# EasyEDA Pro project _Mixer NEXT GEN V3_2026-02-06.epro, board PCB3.0
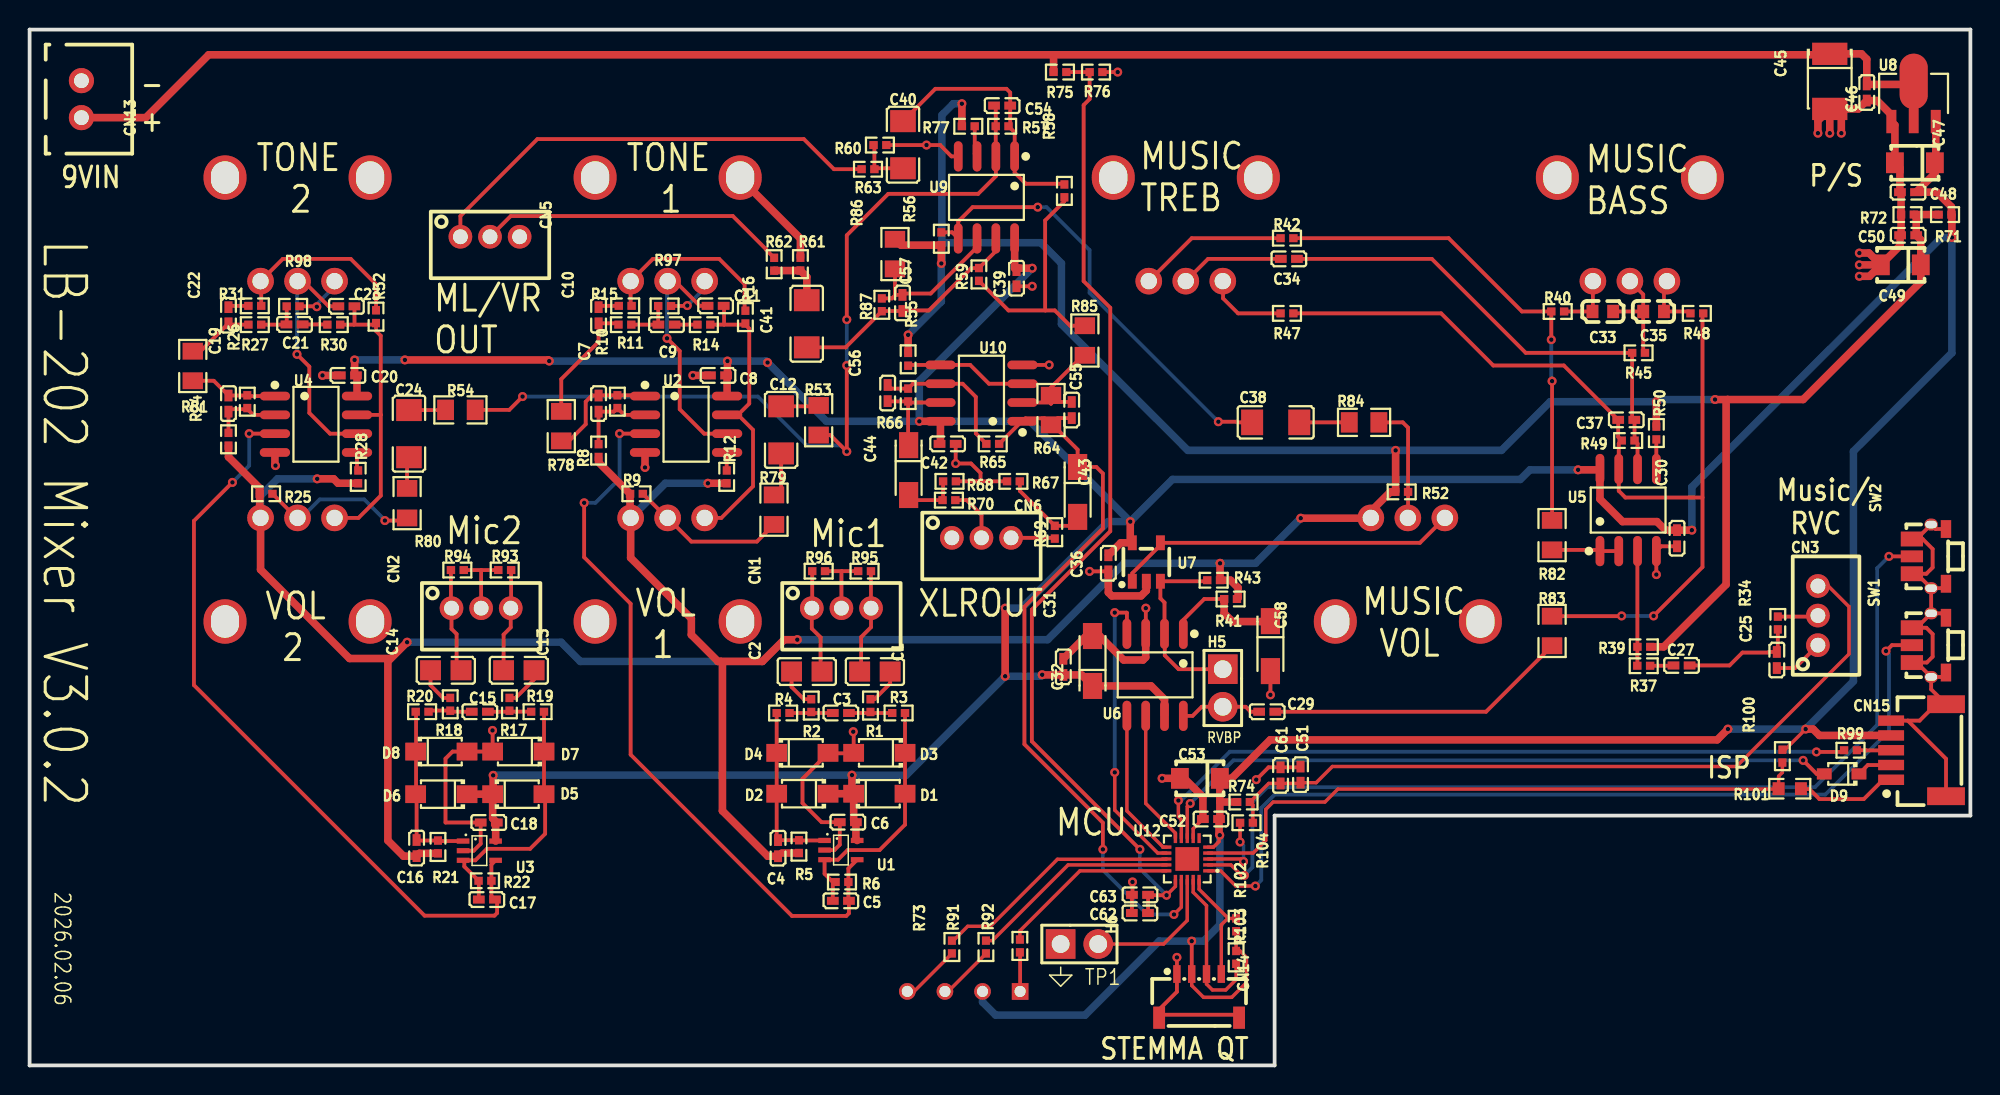
[diagram p6: board, top side]
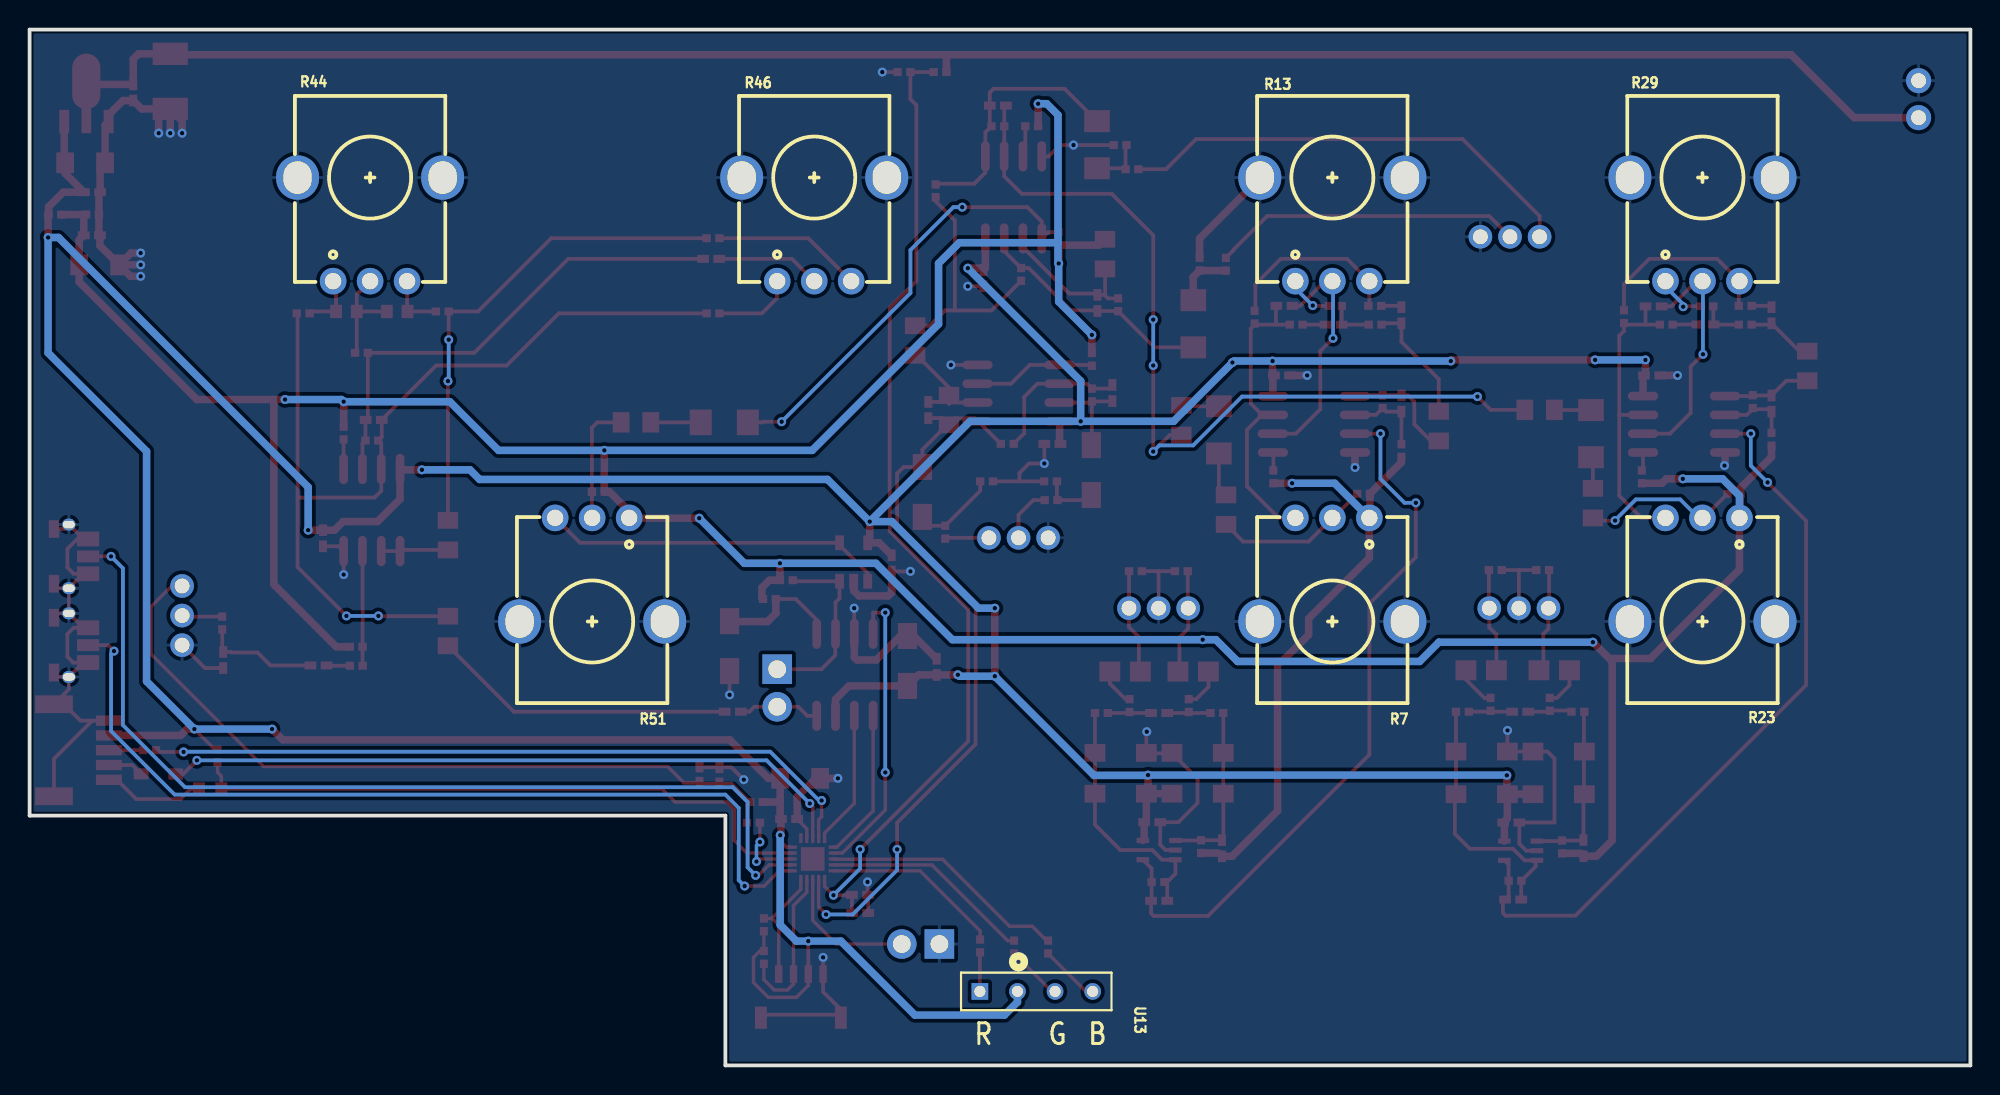
[diagram p7: board, bottom side, seen from below]

Outline 131.1 x 70 mm; copper layers: Top Layer, Bottom Layer. Coordinates in mm from the lower left corner of the outline.
Outline path: 0,70 131.1,70 131.1,16.88 84.1,16.88 84.1,0 0,0 0,70
Stack: Top Layer 0.035mm / Dielectric1 1.51mm FR4 er 4.5 / Bottom Layer 0.035mm

## Design rules (mm)
template: JLCPCB Capability(Two Layers Board)
spacing copperThickness1oz (default): track to track 0.102, other pairs 0.152 to 0.3
spacing copperThickness2oz: track to track 0.203, other pairs 0.152 to 0.3
track width copperThickness1oz (default): min 0.127, default 0.254, max 2.54
track width copperThickness2oz: min 0.203, default 0.254, max 2.54
differential pair differentialPair (default): width min 0.127, default 0.254, max 2.54; gap min 0.152, default 0.152
via viaSize (default): diameter min 0.5, default 0.61, max 10; hole min 0.3, default 0.305, max 6.3

## Placement (name value [footprint] x y rotation side)
C1  22uF  [C0805]  57.1 26.62 0 top
C2  22uF  [C0805]  52.5 26.62 180 top
C3  10nF  [C0402]  54.8 23.82 180 top
C4  20pF  [C0402]  50.56 14.68 270 top
C5  20pF  [C0402]  54.8 11.12 0 top
C6  100nF  [C0402]  55.27 16.44 0 top
C7  20pF  [C0402]  38.43 44.73 90 top
C8  100nF  [C0402]  46.5 46.63 0 top
C9  10nF  [C0402]  43.02 50.06 0 top
C10  10nF  [C0402]  38.43 50.7 90 top
C11  20pF  [C0402]  46.34 51.33 0 top
C12  10uF  [C1206]  50.77 42.95 90 top
C13  22uF  [C0805]  33.05 26.7 0 top
C14  22uF  [C0805]  28.11 26.7 180 top
C15  10nF  [C0402]  30.41 23.9 180 top
C16  20pF  [C0402]  26.14 14.69 270 top
C17  20pF  [C0402]  30.89 11.21 0 top
C18  100nF  [C0402]  31.02 16.42 0 top
C19  20pF  [C0402]  13.43 44.73 90 top
C20  100nF  [C0402]  21.5 46.63 0 top
C21  10nF  [C0402]  17.89 50.08 0 top
C22  10nF  [C0402]  13.43 50.7 90 top
C23  20pF  [C0402]  21.4 51.3 0 top
C24  10uF  [C1206]  25.63 42.69 90 top
C25  47pF  [C0402]  118.02 27.4 90 top
C27  1uF  [C0402]  111.59 27.03 180 top
C29  1uF  [C0402]  83.6 23.9 180 top
C30  100nF  [C0402]  111.28 35.63 270 top
C31  100nF  [C0402]  69.83 26.93 90 top
C32  10uF  [CAP-SMD_L3.2-W1.6-RD-C7171]  71.8 27.33 90 top
C33  47nF  [C0603]  106.27 50.95 180 top
C34  560pF  [C0402]  85.06 54.51 0 top
C35  47nF  [C0603]  109.7 50.95 0 top
C36  100nF  [C0402]  72.87 33.93 90 top
C37  20pF  [C0402]  107.85 43.63 180 top
C38  10uF  [C1206]  84.17 43.46 180 top
C39  100nF  [C0402]  66.67 53.2 90 top
C40  10uF  [C1206]  59 62.22 270 top
C41  10uF  [C1206]  52.49 50.12 90 top
C42  100nF  [C0402]  62.01 42 0 top
C43  10uF  [CAP-SMD_L3.2-W1.6-RD-C7171]  70.79 38.75 270 top
C44  10uF  [CAP-SMD_L3.2-W1.6-RD-C7171]  59.38 40.23 270 top
C45  10uF  [CASE-B_3528]  121.6 66.5 270 top
C46  100nF  [C0402]  124.1 65.75 90 top
C47  22uF  [CAP-SMD_L3.2-W1.6]  127.35 61 180 top
C48  100nF  [C0402]  126.88 59.01 0 top
C49  22uF  [CAP-SMD_L3.2-W1.6]  126.4 54.1 180 top
C50  100nF  [C0402]  126.9 56.1 0 top
C51  100nF  [C0402]  85.85 19.65 270 top
C52  100nF  [C0402]  79.8 16.65 0 top
C53  22uF  [CAP-SMD_L3.2-W1.6]  79.05 19.4 180 top
C54  20pF  [C0402]  65.69 64.86 0 top
C55  20pF  [C0402]  70.39 44.29 270 top
C56  20pF  [C0402]  57.96 45.44 90 top
C57  20pF  [C0402]  58.96 51.53 270 top
C58  10uF  [CAP-SMD_L3.2-W1.6-RD-C7171]  83.82 28.33 270 top
C61  1nF  [C0402]  84.5 19.6 270 top
C62  100nF  [C0402]  75 10.3 0 top
C63  1nF  [C0402]  75.01 11.53 0 top
CN1  B3B-PH-K-S(LF)(SN)  [CONN-TH_B3B-PH-K-S]  54.84 30.9 180 top
CN2  B3B-PH-K-S(LF)(SN)  [CONN-TH_B3B-PH-K-S]  30.5 30.9 180 top
CN3  B3B-PH-K-S(LF)(SN)  [CONN-TH_B3B-PH-K-S]  120.8 30.4 270 top
CN5  B3B-PH-K-S(LF)(SN)  [CONN-TH_B3B-PH-K-S]  31.1 56 180 top
CN6  B3B-PH-K-S(LF)(SN)  [CONN-TH_B3B-PH-K-S]  64.3 35.65 180 top
CN13  B2B-XH-A(LF)(SN)  [CONN-TH_B2B-XH-A-LF-SN]  3.5 65.3 270 top
CN14  HCZZ0039-4  [CONN-SMD_HCZZ0039-4]  79 4.7 0 top
CN15  HC-1.0-5PWT  [CONN-SMD_5P-P1.00_HCTL_HC-1.0-5PWT]  127.6 21.3 90 top
D1  1N4004W  [SOD-123FL_L2.7-W1.8-LS3.8-RD]  57.4 18.36 0 top
D2  1N4004W  [SOD-123FL_L2.7-W1.8-LS3.8-RD]  52.2 18.36 180 top
D3  1N4004W  [SOD-123FL_L2.7-W1.8-LS3.8-RD]  57.4 21.12 180 top
D4  1N4004W  [SOD-123FL_L2.7-W1.8-LS3.8-RD]  52.2 21.12 0 top
D5  1N4004W  [SOD-123FL_L2.7-W1.8-LS3.8-RD]  33.01 18.33 0 top
D6  1N4004W  [SOD-123FL_L2.7-W1.8-LS3.8-RD]  27.81 18.33 180 top
D7  1N4004W  [SOD-123FL_L2.7-W1.8-LS3.8-RD]  33.01 21.21 180 top
D8  1N4004W  [SOD-123FL_L2.7-W1.8-LS3.8-RD]  27.81 21.21 0 top
D9  1N5819WS  [SOD-323_L1.8-W1.3-LS2.5-RD]  122.4 19.7 180 top
H5  PZ254V-11-02P  [HDR-TH_2P-P2.54-V-M]  80.6 25.51 270 top
H6  PZ254V-11-02P  [HDR-TH_2P-P2.54-V-M]  70.91 8.2 0 top
R1  160Ω  [R0402]  56.8 24.32 270 top
R2  160Ω  [R0402]  52.8 24.32 270 top
R3  160Ω  [R0402]  58.7 23.82 0 top
R4  160Ω  [R0402]  50.9 23.82 180 top
R5  2.2kΩ  [R0402]  51.97 14.79 270 top
R6  2.2kΩ  [R0402]  54.88 12.39 0 top
R7  100kΩ  [RES-ADJ-TH_RK09K1130AJ3]  43.1 30 0 bottom
R8  3.3kΩ  [R0402]  38.43 41.55 270 top
R9  15kΩ  [R0402]  40.99 38.63 0 top
R10  20kΩ  [R0402]  39.7 44.85 90 top
R11  22kΩ  [R0402]  40.21 50.06 0 top
R12  47kΩ  [R0402]  47.09 39.77 270 top
R13  100kΩ  [RES-ADJ-TH_RK09K1130AJ3]  43.1 60 180 bottom
R14  5.1kΩ  [R0402]  45.55 50.06 0 top
R15  5.1kΩ  [R0402]  40.23 51.33 0 top
R16  22kΩ  [R0402]  48.35 50.57 270 top
R17  160Ω  [R0402]  32.41 24.4 270 top
R18  160Ω  [R0402]  28.41 24.4 270 top
R19  160Ω  [R0402]  34.31 23.9 0 top
R20  160Ω  [R0402]  26.51 23.9 180 top
R21  2.2kΩ  [R0402]  27.59 14.76 270 top
R22  2.2kΩ  [R0402]  30.76 12.48 0 top
R23  100kΩ  [RES-ADJ-TH_RK09K1130AJ3]  18.1 30 0 bottom
R24  3.3kΩ  [R0402]  13.43 42.31 270 top
R25  15kΩ  [R0402]  15.97 38.63 0 top
R26  20kΩ  [R0402]  14.7 44.85 90 top
R27  22kΩ  [R0402]  15.21 50.06 0 top
R28  47kΩ  [R0402]  22.2 39.77 270 top
R29  100kΩ  [res-adj-th_rk09k1130aj3]  18.1 60 180 bottom
R30  5.1kΩ  [R0402]  20.55 50.06 0 top
R31  5.1kΩ  [R0402]  15.21 51.33 0 top
R32  22kΩ  [R0402]  23.4 50.6 270 top
R34  1kΩ  [R0402]  118.09 29.9 90 top
R37  22kΩ  [R0402]  109.03 27.01 180 top
R39  47kΩ  [R0402]  109.04 28.29 0 top
R40  22kΩ  [R0402]  103.22 50.95 0 top
R41  47kΩ  [R0402]  81.12 31.52 180 top
R42  10kΩ  [R0402]  84.94 55.9 180 top
R43  47kΩ  [R0402]  79.98 32.79 180 top
R44  100kΩ  [RES-ADJ-TH_RK09K1130AJ3]  108.1 60 180 bottom
R45  22kΩ  [R0402]  108.68 48.16 0 top
R46  100kΩ  [RES-ADJ-TH_RK09K1130AJ3]  78.1 60 180 bottom
R47  10kΩ  [R0402]  84.94 50.82 0 top
R48  22kΩ  [R0402]  112.62 50.82 0 top
R49  1MΩ  [R0402]  107.98 42.23 180 top
R50  47kΩ  [R0402]  109.89 42.74 90 top
R51  100kΩ  [RES-ADJ-TH_RK09K1130AJ3]  93.1 30 0 bottom
R52  15kΩ  [R0402]  92.68 38.76 0 top
R53  11kΩ  [R0805]  53.3 43.6 270 top
R54  11kΩ  [R0805]  29.1 44.3 0 top
R55  47kΩ  [R0402]  59.34 47.72 270 top
R56  47kΩ  [R0402]  61.59 55.87 270 top
R57  22kΩ  [R0402]  65.69 63.47 0 top
R58  22kΩ  [R0402]  69.9 59.1 270 top
R59  22kΩ  [R0402]  64.13 53.45 270 top
R60  10kΩ  [R0402]  57.44 62.2 0 top
R61  10kΩ  [R0402]  52.07 54.15 270 top
R62  1kΩ  [R0402]  50.29 54.14 90 top
R63  1kΩ  [R0402]  56.63 60.56 180 top
R64  47kΩ  [R0805]  69 44.29 270 top
R65  10kΩ  [R0402]  65.06 42 0 top
R66  10kΩ  [R0402]  59.34 45.31 90 top
R67  10kΩ  [R0402]  66.46 39.47 0 top
R68  10kΩ  [R0402]  62.14 39.47 0 top
R69  1kΩ  [R0402]  69.25 36.03 270 top
R70  1kΩ  [R0402]  62.1 38.2 0 top
R71  47kΩ  [R0402]  129.39 57.49 180 top
R72  47kΩ  [R0402]  126.85 57.5 180 top
R73  5.1kΩ  [R0402]  62.3 8 90 top
R74  20kΩ  [R0402]  82 17.8 180 top
R75  47kΩ  [R0402]  69.6 67.13 0 top
R76  20kΩ  [R0402]  72.04 67.13 180 top
R77  47kΩ  [R0402]  63.41 63.47 0 top
R78  0Ω  [R0805]  35.91 43.2 90 top
R79  0Ω  [R0805]  50.28 37.56 90 top
R80  0Ω  [R0805]  25.5 38 90 top
R81  0Ω  [R0805]  11.02 47.27 90 top
R82  0Ω  [R0805]  102.84 35.84 90 top
R83  0Ω  [R0805]  102.84 29.36 270 top
R84  0Ω  [R0805]  90.14 43.46 180 top
R85  0Ω  [R0805]  71.28 48.99 90 top
R86  11kΩ  [R0805]  58.46 54.83 270 top
R87  22kΩ  [R0402]  57.57 51.4 270 top
R91  5.1kΩ  [R0402]  64.6 8 90 top
R92  5.1kΩ  [R0402]  66.89 8.07 90 top
R93  47kΩ  [R0402]  32.09 33.48 0 top
R94  47kΩ  [R0402]  28.89 33.48 180 top
R95  47kΩ  [R0402]  56.4 33.4 0 top
R96  47kΩ  [R0402]  53.3 33.4 180 top
R97  100kΩ  [R0402]  42.89 51.33 180 top
R98  100kΩ  [R0402]  17.8 51.3 180 top
R99  100Ω  [R0402]  123 21.3 0 top
R100  10kΩ  [R0402]  118.4 20.9 90 top
R101  0Ω  [R0603]  118.9 18.7 0 top
R102  4.7kΩ  [R0402]  81.5 9.5 270 top
R103  4.7kΩ  [R0402]  81.5 7.3 90 top
R104  1kΩ  [R0402]  82.2 16.4 0 top
SW1  TS-1084-AR03526  [SW-SMD_TS-1084-AR03526]  128.3 28.4 90 top
SW2  TS-1084-AR03526  [SW-SMD_TS-1084-AR03526]  128.3 34.4 90 top
U1  TLV6741DCKR  [SC-70-5_L2.0-W1.3-P0.65-LS2.1-BR]  54.8 14.55 180 top
U2  MCP6002-I/SN  [SOIC-8_L4.9-W3.9-P1.27-LS6.0-BL]  44.34 43.33 270 top
U3  TLV6741DCKR  [SC-70-5_L2.0-W1.3-P0.65-LS2.1-BR]  30.38 14.51 180 top
U4  MCP6002-I/SN  [SOIC-8_L4.9-W3.9-P1.27-LS6.0-BL]  19.34 43.33 270 top
U5  MCP6002-I/SN  [SOIC-8_L4.9-W3.9-P1.27-LS6.0-BL]  107.98 37.53 0 top
U6  LM1971MX/NOPB  [SOIC-8_L4.9-W3.9-P1.27-LS6.0-BL]  76.03 26.39 180 top
U7  MCP6001T-I/OT  [SOT-23-5_L3.0-W1.7-P0.95-LS2.8-BR]  75.44 34.02 270 top
U8  HT7550-1  [SOT-89_L4.5-W2.5-P1.50-LS4.2-BR]  127.26 65.14 270 top
U9  MCP6002-I/SN  [SOIC-8_L4.9-W3.9-P1.27-LS6.0-BL]  64.63 58.66 180 top
U10  MCP6002-I/SN  [SOIC-8_L4.9-W3.9-P1.27-LS6.0-BL]  64.3 45.43 90 top
U12  STC8G1K08-38I-QFN20  [TQFN-20L_L3.0-W3.0-P0.40-BL-EP]  78.2 13.95 90 top
U13  310-47-104-41-001000  [HDR-TH_4P-P2.54-V-F_316-XX-104-41-007000]  63.1 5 180 bottom

## Footprints (pads in the part's own frame, mm; a bottom-side part is the same pattern mirrored in y, then rotated)
C0402
  rect 0.79x0.54 smd: 1(-0.545,0) 2(0.545,0)
C0603
  rect 0.8x0.9 smd: 1(-0.7,0) 2(0.7,0)
C0805
  rect 1.41x1.35 smd: 1(-1.03,0) 2(1.03,0)
C1206
  rect 1.485x1.728 smd: 1(-1.593,0) 2(1.593,0)
CAP-SMD_L3.2-W1.6
  rect 1.2x1.4 smd: 1(-1.35,0) 2(1.35,0)
CAP-SMD_L3.2-W1.6-RD-C7171
  rect 1.758x1.296 smd: 1(-1.687,0) 2(1.687,0)
CASE-B_3528
  rect 1.506x2.376 smd: 1(-1.861,0) 2(1.861,0)
CONN-SMD_5P-P1.00_HCTL_HC-1.0-5PWT
  rect 0.7x1.75 smd: 1(-2.001,1.855) 2(-1,1.855) 3(-0.001,1.855) 4(1,1.855) 5(2,1.855)
  rect 1.2x2.55 smd: 6(3.11,-1.855) 7(-3.11,-1.855)
CONN-SMD_HCZZ0039-4
  rect 0.5x1.2 smd: 1(-1.5,1.475) 2(-0.5,1.475) 3(0.5,1.475) 4(1.5,1.475)
  rect 0.8x1.5 smd: 5(2.7,-1.475) 6(-2.7,-1.475)
CONN-TH_B2B-XH-A-LF-SN
  round 1.7 hole 1: 1(1.25,0) 2(-1.25,0)
CONN-TH_B3B-PH-K-S
  round 1.6 hole 1: 1(2,0) 2(0,0) 3(-2,0)
HDR-TH_2P-P2.54-V-M
  rect 2x2 hole 1.2: 1(-1.27,0)
  round 2 hole 1.2: 2(1.27,0)
HDR-TH_4P-P2.54-V-F_316-XX-104-41-007000
  rect 1.125x1.125 hole 0.75: 1(-3.81,0)
  round 1.125 hole 0.75: 2(-1.27,0) 3(1.27,0) 4(3.81,0)
R0402
  rect 0.566x0.54 smd: 1(-0.433,0) 2(0.433,0)
R0603
  rect 0.806x0.864 smd: 1(-0.753,0) 2(0.753,0)
R0805
  rect 1.133x1.377 smd: 1(-1,0) 2(1,0)
res-adj-th_rk09k1130aj3
  round 1.8 hole 1.1: 1(-2.5,-7) 2(0,-7) 3(2.5,-7)
  oval 2.9x3 hole 1.9x2.2: 4(-4.9,0) 5(4.9,0)
RES-ADJ-TH_RK09K1130AJ3
  round 1.8 hole 1.1: 1(-2.5,-7) 2(0,-7) 3(2.5,-7)
  oval 2.9x3 hole 1.9x2.2: 4(-4.9,0) 5(4.9,0)
SC-70-5_L2.0-W1.3-P0.65-LS2.1-BR
  rect 0.85x0.35 smd: 1(1.1,-0.65) 2(1.1,0) 3(1.1,0.65) 4(-1.1,0.65) 5(-1.1,-0.65)
SOD-123FL_L2.7-W1.8-LS3.8-RD
  rect 1.4x1.2 smd: 1(-1.735,0) 2(1.735,0)
SOD-323_L1.8-W1.3-LS2.5-RD
  rect 1x0.75 smd: 1(-1.173,0) 2(1.173,0)
SOIC-8_L4.9-W3.9-P1.27-LS6.0-BL
  oval 0.588x2.045 smd: 1(-1.905,-2.772) 2(-0.635,-2.772) 3(0.635,-2.772) 4(1.905,-2.772) 5(1.905,2.772) 6(0.635,2.772) 7(-0.635,2.772) 8(-1.905,2.772)
SOT-23-5_L3.0-W1.7-P0.95-LS2.8-BR
  rect 1x0.6 smd: 1(1.3,-0.95) 2(1.3,0) 3(1.3,0.95) 4(-1.3,0.95) 5(-1.3,-0.95)
SOT-89_L4.5-W2.5-P1.50-LS4.2-BR
  rect 1.575x0.672 smd: 1(1.356,-1.5) 3(1.356,1.5)
  custom 5.377x1.9 smd: 2(-1.356,0.009)
SW-SMD_TS-1084-AR03526
  rect 0.8x1.5 smd: 1(0,1.15)
  rect 1x1.5 smd: 2(-1.175,1.15) 2(1.175,1.15)
  rect 1.2x0.7 smd: 3(1.85,-1.15) 4(-1.85,-1.15)
  oval 0.8x0.9 hole 0.5x0.8: 3(2.15,-0.15) 4(-2.15,-0.15)
TQFN-20L_L3.0-W3.0-P0.40-BL-EP
  rect 0.224x0.665 smd: 1(-0.8,-1.407) 2(-0.4,-1.407) 3(0,-1.407) 4(0.4,-1.407) 5(0.8,-1.407) 11(0.8,1.407) 12(0.4,1.407) 13(0,1.407) 14(-0.4,1.407) 15(-0.8,1.407)
  rect 0.665x0.224 smd: 6(1.407,-0.8) 7(1.407,-0.4) 8(1.407,0) 9(1.407,0.4) 10(1.407,0.8) 16(-1.407,0.8) 17(-1.407,0.4) 18(-1.407,0) 19(-1.407,-0.4) 20(-1.407,-0.8)
  rect 1.6x1.6 smd: 21(0,0)

## Nets
As in the schematic, except:
VBATT: C45.1 C46.2 CN13.1 R75.1 U8.2
VGND: C4.2 C16.2 C49.1 C50.2 R5.2 R7.1 R8.2 R9.1 R12.2 R21.2 R23.1 R24.2 R25.1 R28.2 R39.2 R41.1 R43.1 R50.2 R51.1 R52.1 R55.1 R56.2 R71.2 R72.1 R77.1 R86.1

Pads without a net: U12 6 21

## Via types
v1: diameter 0.61, hole 0.305, Top Layer to Bottom Layer, 92 vias

## Routing (per net, layer and track width the routed paths; a pad name or vN(x,y) marks a point on that pad's centre or on a via; arc(x,y) is an arc through that point)
+5V: length 372.8
  Top Layer w0.23: R102.2 R103.2 81.77,7.73 82.2,7.3 82.2,5.6 81.2,4.6 79.3,4.6 78.5,5.4 78.5,6.18 ; U12.5 79.97,14.75 80.34,15.13 80.34,15.61 ; v1(119.97,22.73) 118.58,21.33 118.4,21.33
  Top Layer w0.254: 78.5,6.38 78.5,8.39 78.49,8.4
  Top Layer w0.508: v1(21.95,47.68) 21.95,46.72 C20.2 22.11,46.56 U4.8 ; v1(114.72,22.73) 113.99,22 83.8,22 81.2,19.4 C53.1 80.4,17.83 ; C36.2 73.71,35.32 U7.5 74.35,35.45 v1(74.35,36.75) ; C42.1 61.53,42.06 U10.8 v1(60.1,43.53) ; U3.5 31.48,16.33 C18.2 31.28,16.7 D5.1 ; U1.5 55.82,15.28 C6.2 55.66,16.59 D1.1 ; 80.4,17.83 80.43,17.8 R74.2 ; 80.4,17.83 80.4,16.7 C52.2 80.34,15.61 v1(80.39,15.56) ; v1(31.31,19.6) 31.31,18.36 D5.1 ; D5.1 D6.1 ; v1(65.9,26.3) v1(65.9,30.9) ; D1.1 55.55,18.48 v1(55.55,19.62) ; D1.1 D2.1 ; v1(35.1,47.6) 35.02,47.68 v1(25.35,47.68) ; v1(67.72,53.88) 66.8,53.88 C39.2 66.54,53.87 U9.8 ; v1(112.28,36.17) C30.1 110.51,36.17 109.93,36.75 107.6,36.75 106.08,38.27 U5.8 106.02,40.25 v1(104.6,40.25) ; U6.7 76.66,24.74 75.76,25.64 C32.1 71.06,26.39 C31.1 68.41,26.39 v1(68.4,26.4) ; v1(129.85,55.95) 129.85,57.47 R71.1 129.82,58.02 128.83,59.01 C48.2 128.7,60.28 C47.1 128.76,61.06 128.76,63.78 ; v1(47.14,47.6) 47.14,46.72 47.05,46.63 47.12,46.56 U2.8 ; CN15.4 120.9,22.3 120.47,22.73 v1(119.97,22.73)
  Bottom Layer w0.508: v1(74.35,36.75) 67.57,43.53 v1(60.1,43.53) ; v1(74.35,36.75) 72.85,36.75 67,30.9 v1(65.9,30.9) ; v1(74.35,36.75) 77.2,39.6 100.7,39.6 101.35,40.25 v1(104.6,40.25) ; v1(60.1,43.53) 60.1,46.25 v1(67.72,53.88) ; v1(60.1,43.53) 53.82,43.53 v1(49.85,47.5) 49.75,47.6 v1(47.14,47.6) v1(35.1,47.6) ; v1(21.95,47.68) v1(25.35,47.68) ; v1(80.39,15.56) 80.4,15.55 80.4,9.5 79.3,8.4 v1(78.5,8.4) 76.3,8.4 71.3,3.4 65.25,3.4 64.37,4.28 U13.2 ; v1(114.72,22.73) v1(119.97,22.73) 123.2,25.96 123.2,41.5 129.85,48.15 v1(129.85,55.95) 129.15,55.95 112.28,39.08 v1(112.28,36.17) ; v1(68.4,26.4) 68.3,26.3 v1(65.9,26.3) 59.2,19.6 55.57,19.6 v1(55.55,19.62) 31.33,19.62 v1(31.31,19.6)
GND: length 169.6
  Top Layer w0.23: U12.7 78.6,16 C52.1
  Top Layer w0.254: SW2.4 129.15,32.25 SW2.4 ; 30.51,33.48 30.5,33.47 CN2.2 ; 30.51,33.48 R94.1 ; 30.51,33.48 R93.1 ; 66.67,52.65 v1(67.73,52.65) ; D8.2 28.57,21.21 28.09,20.73 28.09,16.42 C18.1 30.47,14.98 30,14.51 U3.2 ; D8.2 D7.2 31.28,22.63 v1(31.27,22.64) ; D8.2 29.52,21.24 ; 127.15,27.22 127.47,27.22 ; 127.47,27.22 SW1.4 ; 127.47,27.22 128.15,27.22 128.55,27.62 128.55,29.15 128.12,29.58 127.47,29.58 ; 64.24,39.47 R67.1 ; 64.24,39.47 64.24,40.03 63.59,40.68 v1(62.56,40.68) C42.2 ; 64.24,39.47 R68.2 ; v1(75.4,30.9) 75.4,29.18 U6.3 ; CN15.7 129.45,20.72 126.87,23.3 ; R96.1 54.86,33.4 ; 54.86,33.4 54.84,33.37 CN1.2 ; 54.86,33.4 R95.1 ; 127.47,35.58 SW2.3 128.75,36.25 SW2.3 ; 127.47,35.58 SW2.2 ; 127.47,35.58 127.88,35.58 128.55,34.9 128.55,33.65 128.12,33.22 127.47,33.22 ; 127.47,33.22 127.15,33.22 ; 127.47,33.22 SW2.4 ; C36.1 v1(71.6,33.39) ; C58.2 v1(83.82,25.04) ; 127.47,29.58 SW1.2 ; 127.47,29.58 SW1.3 ; v1(77.5,7.3) 77.5,4.97 76.3,3.78 76.3,3.43 81.7,3.43 ; C62.1 74.46,10.31 C63.1 74.5,11.56 v1(74.5,12.4) ; SW1.4 129.15,26.25 SW1.4 ; SW1.4 128.45,25.42 CN15.6 128.78,24.41 127.67,23.3 126.87,23.3 ; v1(55.64,22.55) 55.66,22.52 D3.2 55.63,21.09 53.92,21.09 52.21,19.38 52.21,17.73 53.5,16.44 C6.1 54.73,14.91 54.37,14.55 U1.2 ; SW1.3 129.15,30.55 SW1.3 ; SW1.3 SW2.4 ; R76.1 v1(73.5,67.13) ; R60.2 v1(60.59,62.2) 61.5,62.2 62.27,61.43 U9.4 ; U10.4 v1(68.87,47.34) ; 126.87,23.3 CN15.5 ; v1(82.86,19.31) 83.69,20.14 C61.1 85.8,20.14 C51.1 ; CN3.1 119.25,26.85 C25.1 ; C30.2 110.21,35.08 U5.4 v1(109.89,33.17)
  Top Layer w0.508: R61.1 52.07,55.88 48,59.95 R13.4 ; U6.3 75.39,27.58 75.21,27.4 73.9,27.4 72.28,29.02 C32.2 71.37,29.02 C31.2 ; v1(120.8,63) 120.8,63.84 C45.2 ; C45.2 v1(121.6,63) ; C45.2 123.53,64.64 C46.1 124.79,65.2 125.76,64.24 125.76,63.78 126,63.55 C47.2 126.34,60.66 C48.1 126.42,58.94 R72.2 126.42,56.17 C50.1 126.35,55.4 C49.2 ; U4.4 16.57,40.57 v1(16.61,40.54) ; C8.1 v1(44.8,46.63) ; C49.2 124.28,53.33 v1(123.6,53.33) ; C49.2 124.25,54.9 v1(123.6,54.9) ; C49.2 v1(123.6,54.1) ; C36.1 72.87,31.96 73.1,31.73 75.08,31.73 75.44,32.09 U7.2 ; C20.1 v1(19.78,46.63) ; C52.1 79.25,18.14 78,19.4 C53.2 v1(76.5,19.4) ; 122.38,63.86 v1(122.38,63) ; U2.4 v1(41.57,40.41)
VBATT: length 128.7
  Top Layer w0.508: 69.16,68.3 12.1,68.3 7.85,64.05 CN13.1 ; 69.16,68.3 121.54,68.3 C45.1 123.74,68.36 124.1,68 C46.2 127.07,66.3 U8.2 ; 69.16,68.3 69.17,68.29 R75.1
BATMON: length 67.9
  Top Layer w0.23: v1(76.8,11.5) 77.4,12.1 U12.16
  Top Layer w0.254: R75.2 R76.2 71.6,65.3 71.2,64.9 71.2,53 73,51.2 73,36.1 67.7,30.8 67.7,21.9 v1(75,14.6) ; C62.2 75.55,10.31 C63.2 75.58,11.5 v1(76.8,11.5)
  Bottom Layer w0.254: v1(75,14.6) 75,13.3 v1(76.8,11.5)
MICOUT1: length 2.6
  Top Layer w0.254: R53.1 53.24,44.54 C12.2
MICOUT2: length 2.5
  Top Layer w0.254: C24.2 28.09,44.29 R54.1
MUSICOUT: length 21
  Top Layer w0.254: R62.2 49.77,55.1 49.77,55.13 47.5,57.4 32.5,57.4 CN5.2
MUSICOUT1: length 30.4
  Top Layer w0.254: R56.1 62.32,56.3 U9.5 62.73,57.03 63.7,58 v1(68.1,58) ; v1(80.3,43.5) 81.54,43.5 81.58,43.46 C38.2
  Bottom Layer w0.254: v1(68.1,58) 68.7,58 71.6,55.1 71.6,52.2 v1(80.3,43.5)
OUTMON: length 51.3
  Top Layer w0.23: U12.17 77.8,10.7 v1(77.3,10.2)
  Top Layer w0.254: R64.2 69.12,43.29 70.79,41.61 70.79,40.44 72.06,40.44 72.5,40 72.5,36.3 67.2,31 67.2,21.7 72.5,16.4 v1(72.5,14.6) ; R64.2 68.56,43.73 67.27,43.73 U10.1 67.02,43.53 R65.2 ; R64.2 69.45,43.74 C55.2
  Bottom Layer w0.254: v1(72.5,14.6) 72.5,13.2 75.5,10.2 v1(77.3,10.2)
RST/P5.4: length 43.4
  Top Layer w0.23: R100.1 118.4,19.8 118.15,19.55 R101.1 118.12,18.67 88.37,18.67 87.5,17.8 84,17.8 83.5,17.3 83.5,15.2 82.65,14.35 U12.4
RXD/P3.0: length 46.8
  Top Layer w0.23: v1(78.4,17.7) 78.2,17.5 U12.8
  Top Layer w0.254: v1(119.8,20.62) 120.72,19.7 D9.2
  Bottom Layer w0.254: v1(78.4,17.7) 81.32,20.62 v1(119.8,20.62)
SCL: length 7.9
  Top Layer w0.23: R102.1 80.97,9.93 ; 80.97,9.93 79,11.9 U12.20 ; 80.97,9.93 80.93,9.93 80.5,9.5 80.5,6.18
SDA: length 10.9
  Top Layer w0.23: R103.1 81.5,5.8 80.8,5.1 79.9,5.1 79.5,5.5 79.5,10.8 78.6,11.7 U12.19
SWITCH1: length 61
  Top Layer w0.23: U12.1 80.45,13.15 81.48,12.12 v1(82.8,12.12)
  Top Layer w0.254: SW1.1 125.8,28.4 v1(125.4,28)
  Bottom Layer w0.254: v1(82.8,12.12) 83.2,12.52 83.2,17.4 84.1,18.3 121.3,18.3 125.6,22.6 125.6,27.8 v1(125.4,28)
SWITCH2: length 65.6
  Top Layer w0.23: v1(82.06,12.84) 81.86,12.84 81.15,13.55 U12.2
  Top Layer w0.254: v1(125.6,34.4) SW2.1
  Bottom Layer w0.254: v1(125.6,34.4) 124.8,33.6 124.8,23 120.6,18.8 83.6,18.8 82.6,17.8 82.6,13.39 v1(82.06,12.84)
TP1: length 9.4
  Top Layer w0.23: H6.2 76.6,8.2 78.2,9.8 U12.18
TXD/P3.1: length 49
  Top Layer w0.23: U12.9 77.8,16.6 77.6,16.8 v1(77.6,17.9)
  Top Layer w0.254: R99.1 122.45,21.18 v1(120.7,21.18)
  Bottom Layer w0.254: v1(120.7,21.18) 120.68,21.2 81.07,21.2 77.77,17.9 v1(77.6,17.9)
VGND: length 303.6
  Top Layer w0.508: R86.1 58.85,55.43 R56.2 v1(61.59,54.2) ; 46.7,27.3 49.5,27.3 50.97,28.77 v1(51.86,28.77) ; 46.7,27.3 46.5,27.3 44.7,29.1 44.7,30.2 40.6,34.3 40.6,36.9 ; 46.7,27.3 46.8,27.2 46.8,17.2 49.87,14.13 C4.2 ; 114.7,45 114.6,44.9 114.6,32.5 110.39,28.29 R39.2 ; 114.7,45 119.8,45 127.75,52.95 C49.1 127.75,55.79 C50.2 127.44,57.34 R72.1 128.95,57.5 R71.2 ; 114.7,45 v1(113.85,45) ; 27.59,14.33 26.33,14.33 C16.2 25.26,14.14 24.2,15.2 24.2,27.3 v1(25.5,28.6) ; v1(92.27,41.56) 92.27,38.78 R52.1 91.92,38.76 90.6,37.44 R51.1 90.58,36.98 v1(85.86,36.98) ; R5.2 50.81,14.35 ; v1(80.41,33.93) R43.1 81.12,32.79 81.63,32.28 81.63,31.59 R41.1 ; R24.2 13.43,41.12 15.54,39.01 R25.1 15.54,37.06 R23.1 15.6,33.51 21.61,27.5 24.36,27.5 ; R8.2 38.43,40.76 R9.1 40.56,37.04 ; R77.1 v1(62.98,64.99) ; R12.2 v1(45.82,39.34) ; R28.2 20.84,39.34 20.54,39.64 v1(19.43,39.64) ; 50.57,14.12 50.57,14.11 ; R50.2 v1(109.89,44.85) ; v1(59.34,49.37) R55.1
  Bottom Layer w0.508: v1(45.82,39.34) 42.94,39.34 R7.1 ; v1(25.5,28.6) 35.9,28.6 37.2,27.3 49.5,27.3 50.97,28.77 v1(51.86,28.77) 68.77,28.77 73.93,33.93 v1(80.41,33.93) 82.82,33.93 v1(85.86,36.98) ; 61.63,55.6 61.63,64.23 62.39,64.99 v1(62.98,64.99) ; 61.63,55.6 61.63,54.24 v1(61.59,54.2) 61.59,51.61 v1(59.34,49.37) ; 61.63,55.6 68.3,55.6 69.7,54.2 69.7,50.1 78.24,41.56 v1(92.27,41.56) 99.42,41.56 102.72,44.85 v1(109.89,44.85) 110.03,45 v1(113.85,45) ; v1(19.43,39.64) 16.74,39.64 15.6,38.5 R23.1
VOICEOUT: length 31.5
  Top Layer w0.254: CN5.1 29.1,57.4 34.3,62.6 52.3,62.6 54.34,60.56 R63.2
VOL_ADC1: length 52
  Top Layer w0.23: CN3.3 121.5,32.4 122.9,31 122.9,27.8 115.3,20.2 88,20.2 86.91,19.11 C51.2 85.8,19.06 83.7,19.06 82.45,17.8 R74.1 82.63,17.6 R104.2
VOL_CLK: length 9.1
  Top Layer w0.23: U6.6 75.39,17.71 77.4,15.7 U12.10
VOL_DATA: length 10.1
  Top Layer w0.23: U6.5 74.12,17.2 76.57,14.75 U12.11
VOL_LOAD: length 20.3
  Top Layer w0.23: v1(73.3,19.8) 73.3,17.26 76.21,14.35 U12.12
  Top Layer w0.254: U6.4 74.12,30.58 74.1,30.6 v1(73.3,30.6)
  Bottom Layer w0.254: v1(73.3,30.6) v1(73.3,19.8)
$1N20667: length 1.5
  Top Layer w0.254: C9.2 R14.1
$1N20668: length 1.4
  Top Layer w0.254: R15.1 38.52,51.33 C10.2
$1N20669: length 12.5
  Top Layer w0.254: R16.1 48.3,51.05 48.3,52.79 46.58,54.51 42.11,54.51 R13.3 40.6,51.39 R15.2
$1N20670: length 3.1
  Top Layer w0.254: R97.2 42.46,50.08 C9.1 R11.2
$1N25442: length 2.5
  Top Layer w0.254: 58.13,26.52 58.13,25.81 57.07,24.75 56.8,24.75
$1N25481: length 2.6
  Top Layer w0.254: 52.8,24.75 52.3,24.75 51.47,25.58 51.47,26.52
$1N25706: length 2.9
  Top Layer w0.254: C3.1 58.2,23.82 58.23,23.84
$1N25711: length 2.9
  Top Layer w0.254: R4.1 C3.2
$1N26543: length 1.2
  Top Layer w0.254: 47.09,40.28 47.09,41.39 U2.5
$1N28301: length 17.1
  Top Layer w0.254: 59.07,18.36 D1.2 ; D1.2 59.13,16.27 57.41,14.55 55.26,14.55 54.61,13.9 U1.3 53.7,12.95 54.25,12.39 ; D1.2 D3.1 59.13,23.68 ; C5.1 54.25,12.39 ; 54.25,12.39 R6.1
$1N28981: length 16.3
  Top Layer w0.254: R13.2 43.6,53 45.27,51.33 C11.1 ; U2.6 45.57,42.69 43.91,44.35 43.91,48.28 v1(43.05,49.14)
  Bottom Layer w0.254: v1(43.05,49.14) 43.05,52.95 R13.2
$1N29047: length 5.6
  Top Layer w0.254: 38.43,41.98 C7.1 39.46,44.18 R10.1 40.16,43.96 U2.2
$1N29316: length 7
  Top Layer w0.254: C1.1 56.17,26.72 56.17,28.95 56.84,29.62 56.84,30.72 56.83,30.72 56.83,33.3
$1N29420: length 11.9
  Top Layer w0.254: 50.47,23.7 50.47,23.69 D4.1 D2.2 50.47,15.34 ; 50.47,15.34 50.59,15.22 ; 50.47,15.34 50.47,15.31 50.57,15.2 50.59,15.22 ; 50.59,15.22 R5.1 51.99,15.2 U1.1
$1N30744: length 3
  Top Layer w0.254: R79.2 50.77,39.04 C12.1
$1N35236: length 8.1
  Top Layer w0.254: 35.91,44.47 35.91,46.38 38.43,48.9 C10.1 39.69,50.15 39.78,50.06
$1N35251: length 8
  Top Layer w0.254: 35.91,41.93 36.17,41.93 37.56,43.33 37.56,44.85 37.98,45.27 C7.2 38.45,45.29 R10.2 41.52,45.29 U2.1
$1N35514: length 20.3
  Top Layer w0.254: 47.85,43.97 48.87,42.95 48.87,39.14 46.73,37 R7.3 ; 47.85,43.97 47.12,43.97 U2.7 ; 47.85,43.97 48.61,44.73 48.61,49.79 48.34,50.06 46.91,50.06 ; C11.2 46.91,51.3 46.91,50.06 ; 46.91,50.06 R14.2
$1N35542: length 10.7
  Top Layer w0.254: R9.2 43.06,37 43.1,37 44.7,35.4 49.13,35.4 R79.1
$1N35580: length 49.3
  Top Layer w0.254: C5.2 55.34,10.28 55.17,10.1 51.5,10.1 40.6,21 40.6,31.2 37.46,34.34 v1(37.46,38.02) ; U2.3 41.57,42.69 v1(39.85,42.69) ; U1.4 55.31,13.31 R6.2 55.31,11.16
  Bottom Layer w0.254: v1(39.85,42.69) 39.85,39.65 38.22,38.02 v1(37.46,38.02)
$1N37557: length 7
  Top Layer w0.254: C2.1 53.43,26.72 53.43,28.92 52.84,29.52 52.84,30.72 52.87,30.75 52.87,33.3
$1N42831: length 3.2
  Top Layer w0.254: R97.1 44.4,51.33 v1(44.42,51.35)
  Bottom Layer w0.254: R13.1 45.6,52.53 v1(44.42,51.35)
$2N20964: length 1.7
  Top Layer w0.254: R30.1 20.1,50.08 C21.2
$2N20966: length 1.4
  Top Layer w0.254: C22.2 13.52,51.33 14.78,51.33
$2N20968: length 12.5
  Top Layer w0.254: R32.1 23.4,52.8 21.69,54.51 17.11,54.51 15.64,53.05 R31.2
$2N20969: length 2.9
  Top Layer w0.254: R98.2 17.37,50.09 C21.1 17.34,50.06 R27.2
$2N20975: length 2.8
  Top Layer w0.254: R17.1 32.83,24.83 34.06,26.07 34.06,26.69 C13.2
$2N20977: length 2.6
  Top Layer w0.254: R18.1 27.93,24.83 27.08,25.68 27.08,26.6
$2N20979: length 3
  Top Layer w0.254: C15.1 32.43,23.9 32.52,23.98 32.59,23.91 33.88,23.91
$2N20982: length 3
  Top Layer w0.254: C15.2 28.44,23.9 28.44,23.98 27,23.98 27,23.91
$2N20986: length 1.2
  Top Layer w0.254: U4.5 22.11,40.31 22.08,40.28
$2N20988: length 17.7
  Top Layer w0.254: 34.75,23.91 34.75,23.91 ; C17.1 30.34,12.46 R22.1 29.36,13.44 29.36,13.78 U3.3 30.11,13.86 30.89,14.64 33.81,14.64 34.82,15.65 34.82,18.25 D5.2 D7.1 34.75,23.9 R19.2
$2N21045: length 16.5
  Top Layer w0.254: C23.1 20.2,51.3 18.5,53 R29.2 ; U4.6 20.29,42.69 18.89,44.09 18.89,47.22 v1(18.06,48.06)
  Bottom Layer w0.254: v1(18.06,48.06) 18.06,52.96 R29.2
$2N21050: length 4.9
  Top Layer w0.254: U4.2 15.1,43.96 14.72,44.35 13.43,44.35 R24.1
$2N21072: length 7
  Top Layer w0.254: C13.1 32.02,29.12 32.5,29.6 CN2.3 32.53,30.93 R93.2
$2N21083: length 11.9
  Top Layer w0.254: U3.1 27.62,15.16 R21.1 26.17,15.2 C16.1 26.14,18.27 D6.2 26.1,18.36 26.1,21.24 ; 26.1,21.24 26.1,23.88 26.14,23.91 ; 26.1,21.24 D8.1
$2N22314: length 2
  Top Layer w0.254: R80.2 25.5,40.98
$2N22318: length 20.9
  Top Layer w0.254: 21.91,50.06 23.29,50.06 23.4,50.17 23.4,49.63 23.72,49.31 23.72,43.96 ; 21.91,50.06 R30.2 ; 21.91,50.06 21.94,50.1 C23.2 ; 23.72,43.96 23.72,38.5 22.22,37 R23.3 ; 23.72,43.96 U4.7
$2N22360: length 4.6
  Top Layer w0.254: R81.2 11.55,48.27 C22.1 13.52,50.06 14.78,50.06
$2N25778: length 11
  Top Layer w0.254: R25.2 18.04,37 R23.2 ; v1(24,36.82) 25.32,36.82 R80.1
  Bottom Layer w0.254: v1(24,36.82) 24,36.85 22.6,38.25 19.6,38.25 18.35,37 R23.2
$2N25871: length 51.1
  Top Layer w0.254: v1(14.83,42.69) 16.57,42.69 U4.3 ; U3.4 31.19,13.57 R22.2 31.19,11.45 31.58,11.06 31.58,10.3 31.4,10.12 26.68,10.12 11.1,25.7 11.1,36.8 v1(13.7,39.4)
  Bottom Layer w0.254: v1(13.7,39.4) 14.83,40.53 v1(14.83,42.69)
$2N25928: length 6
  Top Layer w0.254: R81.1 12.44,46.27 C19.2 14.69,45.27 R26.2 14.76,45.23 U4.1
$2N27932: length 7.1
  Top Layer w0.254: R94.2 28.46,30.94 CN2.1 28.5,29.5 28.84,29.16 28.84,27 C14.1
$2N32117: length 3.4
  Top Layer w0.254: v1(19.4,51.27) 19.37,51.3 18.23,51.3
  Bottom Layer w0.254: v1(19.4,51.27) 19.4,51.44 20.6,52.64 R29.1
$6N485: length 1.6
  Top Layer w0.254: R37.1 111.02,27.01 C27.2
$6N8330: length 7.8
  Top Layer w0.254: U5.3 108.61,34.75 R39.1 108.61,27.02 R37.2
$6N8938: length 7.8
  Top Layer w0.254: R34.1 118.09,28.01 C25.2 117.5,27.94 117.46,27.9 115.7,27.9 114.83,27.03 C27.1
$6N11279: length 7
  Top Layer w0.254: R46.2 79.61,54.51 C34.1
$6N11282: length 10.1
  Top Layer w0.254: R46.3 78.5,55.9 R42.2
$6N11283: length 5.5
  Top Layer w0.254: R46.1 80.62,52.98 80.62,51.84 81.63,50.82 R47.1
$6N11290: length 33.3
  Top Layer w0.254: U5.6 108.62,42.03 R49.1 108.41,43.61 C37.1 108.25,43.78 R45.1 101.06,48.16 94.71,54.51 85.61,54.51
$6N13703: length 2.7
  Top Layer w0.254: R34.2 120.73,30.33 CN3.2
$6N16037: length 4
  Top Layer w0.254: R44.3 105.6,50.98 C33.2 R40.2
$6N16040: length 7.3
  Top Layer w0.254: R44.2 109,52.1 C35.1 ; 106.97,50.95 C35.1 ; C35.1 109,48.27 R45.2
$6N16049: length 4
  Top Layer w0.254: R44.1 110.4,52.8 C35.2 112.06,50.95 R48.1
$6N19592: length 2
  Top Layer w0.254: R50.1 U5.5
$6N21767: length 23.3
  Top Layer w0.254: R51.3 93.92,35.32 U7.4 76.32,35.26 76.32,35.1 74.49,33.26 U7.1
$6N22965: length 33.6
  Top Layer w0.254: v1(102.79,49.05) R40.1 100.81,50.95 95.86,55.9 R42.1 ; v1(102.84,46.24) R82.2
  Bottom Layer w0.254: v1(102.79,49.05) 102.79,46.3 v1(102.84,46.24)
$6N23115: length 3.4
  Top Layer w0.254: R84.2 C38.1
$6N26920: length 4.5
  Top Layer w0.254: R82.1 106,34.84 U5.1 U5.2
$6N26939: length 64.4
  Top Layer w0.254: 113,38.38 113,33.68 v1(109.7,30.38) ; 113,38.38 107.79,38.38 107.35,38.83 U5.7 107.35,42.03 R49.2 107.31,42.47 107.31,43.63 103.64,47.3 98.87,47.3 95.35,50.82 R47.2 ; 113,38.38 113,50.77 R48.2 ; R83.1 107.53,30.36 v1(107.54,30.38)
  Bottom Layer w0.254: v1(107.54,30.38) v1(109.7,30.38)
$6N26968: length 8.2
  Top Layer w0.254: R51.2 93.11,37.02 R52.2 93.11,43.1 92.76,43.46 R84.1
$6N31799: length 20.4
  Top Layer w0.254: 84.59,23.9 98.38,23.9 R83.2 ; C29.1 84.49,23.9
$6N32061: length 8.6
  Top Layer w0.254: R41.2 79.35,31.52 77.93,30.1 U6.1
  Top Layer w0.508: C58.1 83.79,30 81.25,30 80.69,30.56 R41.2
$6N32096: length 5.5
  Top Layer w0.254: C29.2 82.48,23.9 82.15,24.24 H5.2 79.18,24.24 78.56,23.62 U6.8
$6N32112: length 12.6
  Top Layer w0.254: H5.1 77.61,26.78 76.68,27.71 76.68,29.15 U6.2 76.66,31.28 76.39,31.56 U7.3 79.48,32.72 R43.2
$8N548: length 5.8
  Top Layer w0.254: C43.2 70.19,36.47 R69.1 66.89,38.83 66.89,39.46
$8N551: length 3.7
  Top Layer w0.254: C44.2 59.72,38.2 R70.1 61.71,38.24 R68.1
$8N1825: length 3.6
  Top Layer w0.254: R60.1 57.07,62.14 R63.1 57.13,60.63 C40.2
$8N2251: length 4.3
  Top Layer w0.508: 52.5,51.42 52.5,53.28 R61.2 50.3,53.72 R62.1
$8N6158: length 3
  Top Layer w0.254: CN6.3 69.2,35.65 R69.2
$8N9357: length 16.6
  Top Layer w0.254: R85.2 70.28,49.99 69.25,51.02 68.62,51.02 ; 69.9,58.67 69.9,58.4 68.6,57.1 68.6,51.04 68.62,51.02 ; 68.62,51.02 66.13,51.02 R59.2
$8N10186: length 8.2
  Top Layer w0.254: 59.4,47.34 U10.5 63.54,47.34 64.81,46.07 U10.3
$8N10241: length 2.1
  Top Layer w0.254: R77.2 63.84,61.59 U9.3
$8N11190: length 10
  Top Layer w0.254: C56.2 58.21,45.74 R66.2 59.67,46.07 U10.6 63.03,46.07 63.92,45.18 63.92,42.71 R65.1
$8N11211: length 6.6
  Top Layer w0.254: R66.1 59.42,44.8 U10.7 ; R66.1 57.98,44.87 C56.1 ; R66.1 59.34,41.95 C44.1
$8N11256: length 60.5
  Top Layer w0.254: R54.2 32.4,44.3 v1(33.3,45.2) ; R53.2 54.09,42.6 v1(55.2,41.49) v1(55.2,47.3) ; v1(55.2,50.4) 55.2,56.1 58,58.9 64.08,58.9 65.27,60.09 U9.2 65.26,61.44 R57.1 65.26,64.75 C54.1
  Bottom Layer w0.254: v1(55.2,47.3) v1(55.2,50.4) ; v1(55.2,41.49) 54.79,41.9 52.5,41.9 49.2,45.2 v1(33.3,45.2)
$8N11268: length 17.6
  Top Layer w0.254: C40.1 61.18,66 65.99,66 66.24,65.75 C54.2 66.24,63.58 R57.2 66.54,63.05 U9.1 66.54,60.34 67.29,59.58 69.85,59.58 R58.1
$8N12340: length 7.7
  Top Layer w0.254: 69,44.72 68.92,44.8 U10.2 ; 69,44.72 69,45.81 71.17,47.99 R85.1 ; 69,44.72 69.11,44.83 C55.1
$8N12517: length 10.2
  Top Layer w0.254: 58.46,52.07 R86.2 ; 58.46,52.07 58.46,52.04 58.25,51.83 R87.1 ; 58.46,52.07 C57.1 59.05,52.16 60.87,52.16 64,55.29 U9.6
$8N12572: length 16.3
  Top Layer w0.254: U9.7 65.27,55.03 64.13,53.89 63.61,53.89 60.74,51.02 59,51.02 C57.2 57.58,50.98 R87.2 55.13,48.53 C41.1
$8N14533: length 3.7
  Top Layer w0.254: CN6.2 64.3,35.66 64.3,37.2 63.3,38.2 R70.2
$9N10742: length 4.1
  Top Layer w0.23: U13.4 59.75,5 62.3,7.55 R73.1
$9N10748: length 3.8
  Top Layer w0.23: R91.1 64.6,7.55 62.05,5 U13.3
$9N10755: length 2.7
  Top Layer w0.254: U13.1 66.91,7.64 66.89,7.64
$9N12859: length 14.3
  Top Layer w0.23: R91.2 65.03,8.43 70.15,13.55 U12.14
$9N13226: length 12.2
  Top Layer w0.23: 66.89,8.51 66.89,9.09 70.95,13.15 U12.15
$9N13231: length 16.8
  Top Layer w0.23: R73.2 62.4,8.43 63.37,9.4 64.9,9.4 69.43,13.93 76.77,13.93 U12.13
$9N16093: length 7
  Top Layer w0.254: CN15.1 125.2,19.3 123.9,18 120.9,18 120.23,18.67 119.56,18.67
$9N16100: length 2.4
  Top Layer w0.254: D9.1 124.17,20.3 CN15.2
$9N16109: length 2.3
  Top Layer w0.254: CN15.3 125.73,21.29 124.05,21.29 124.04,21.3 R99.2
$9N18983: length 5.2
  Top Layer w0.23: U12.3 81.83,13.95 v1(82,13.78) ; R104.1 v1(81.77,15.1)
  Bottom Layer w0.23: v1(82,13.78) 82,14.87 v1(81.77,15.1)

## Copper pours and planes (outline as drawn; the poured copper is in the pictures)
GND on Bottom Layer: 131.3,-0.1 -0.2,-0.1 -0.2,70 131.3,70

## Text on the board
Bottom Silkscreen Layer: B | G | R
Top Silkscreen Layer: RVBP | TP1 | 2026.02.06 | - | + | STEMMA QT | ISP | 9VIN | Music/ / RVC | P/S | MUSIC / TREB | MUSIC / BASS | TONE / 2 | VOL / 2 | ML/VR / OUT | Mic2 | TONE / 1 | VOL / 1 | Mic1 | XLROUT | MCU | MUSIC / VOL | LB-202 Mixer V3.0.2
